# Altium schematic sheet 5-BLOCK-2X2-DUAL.SchDoc
size A2
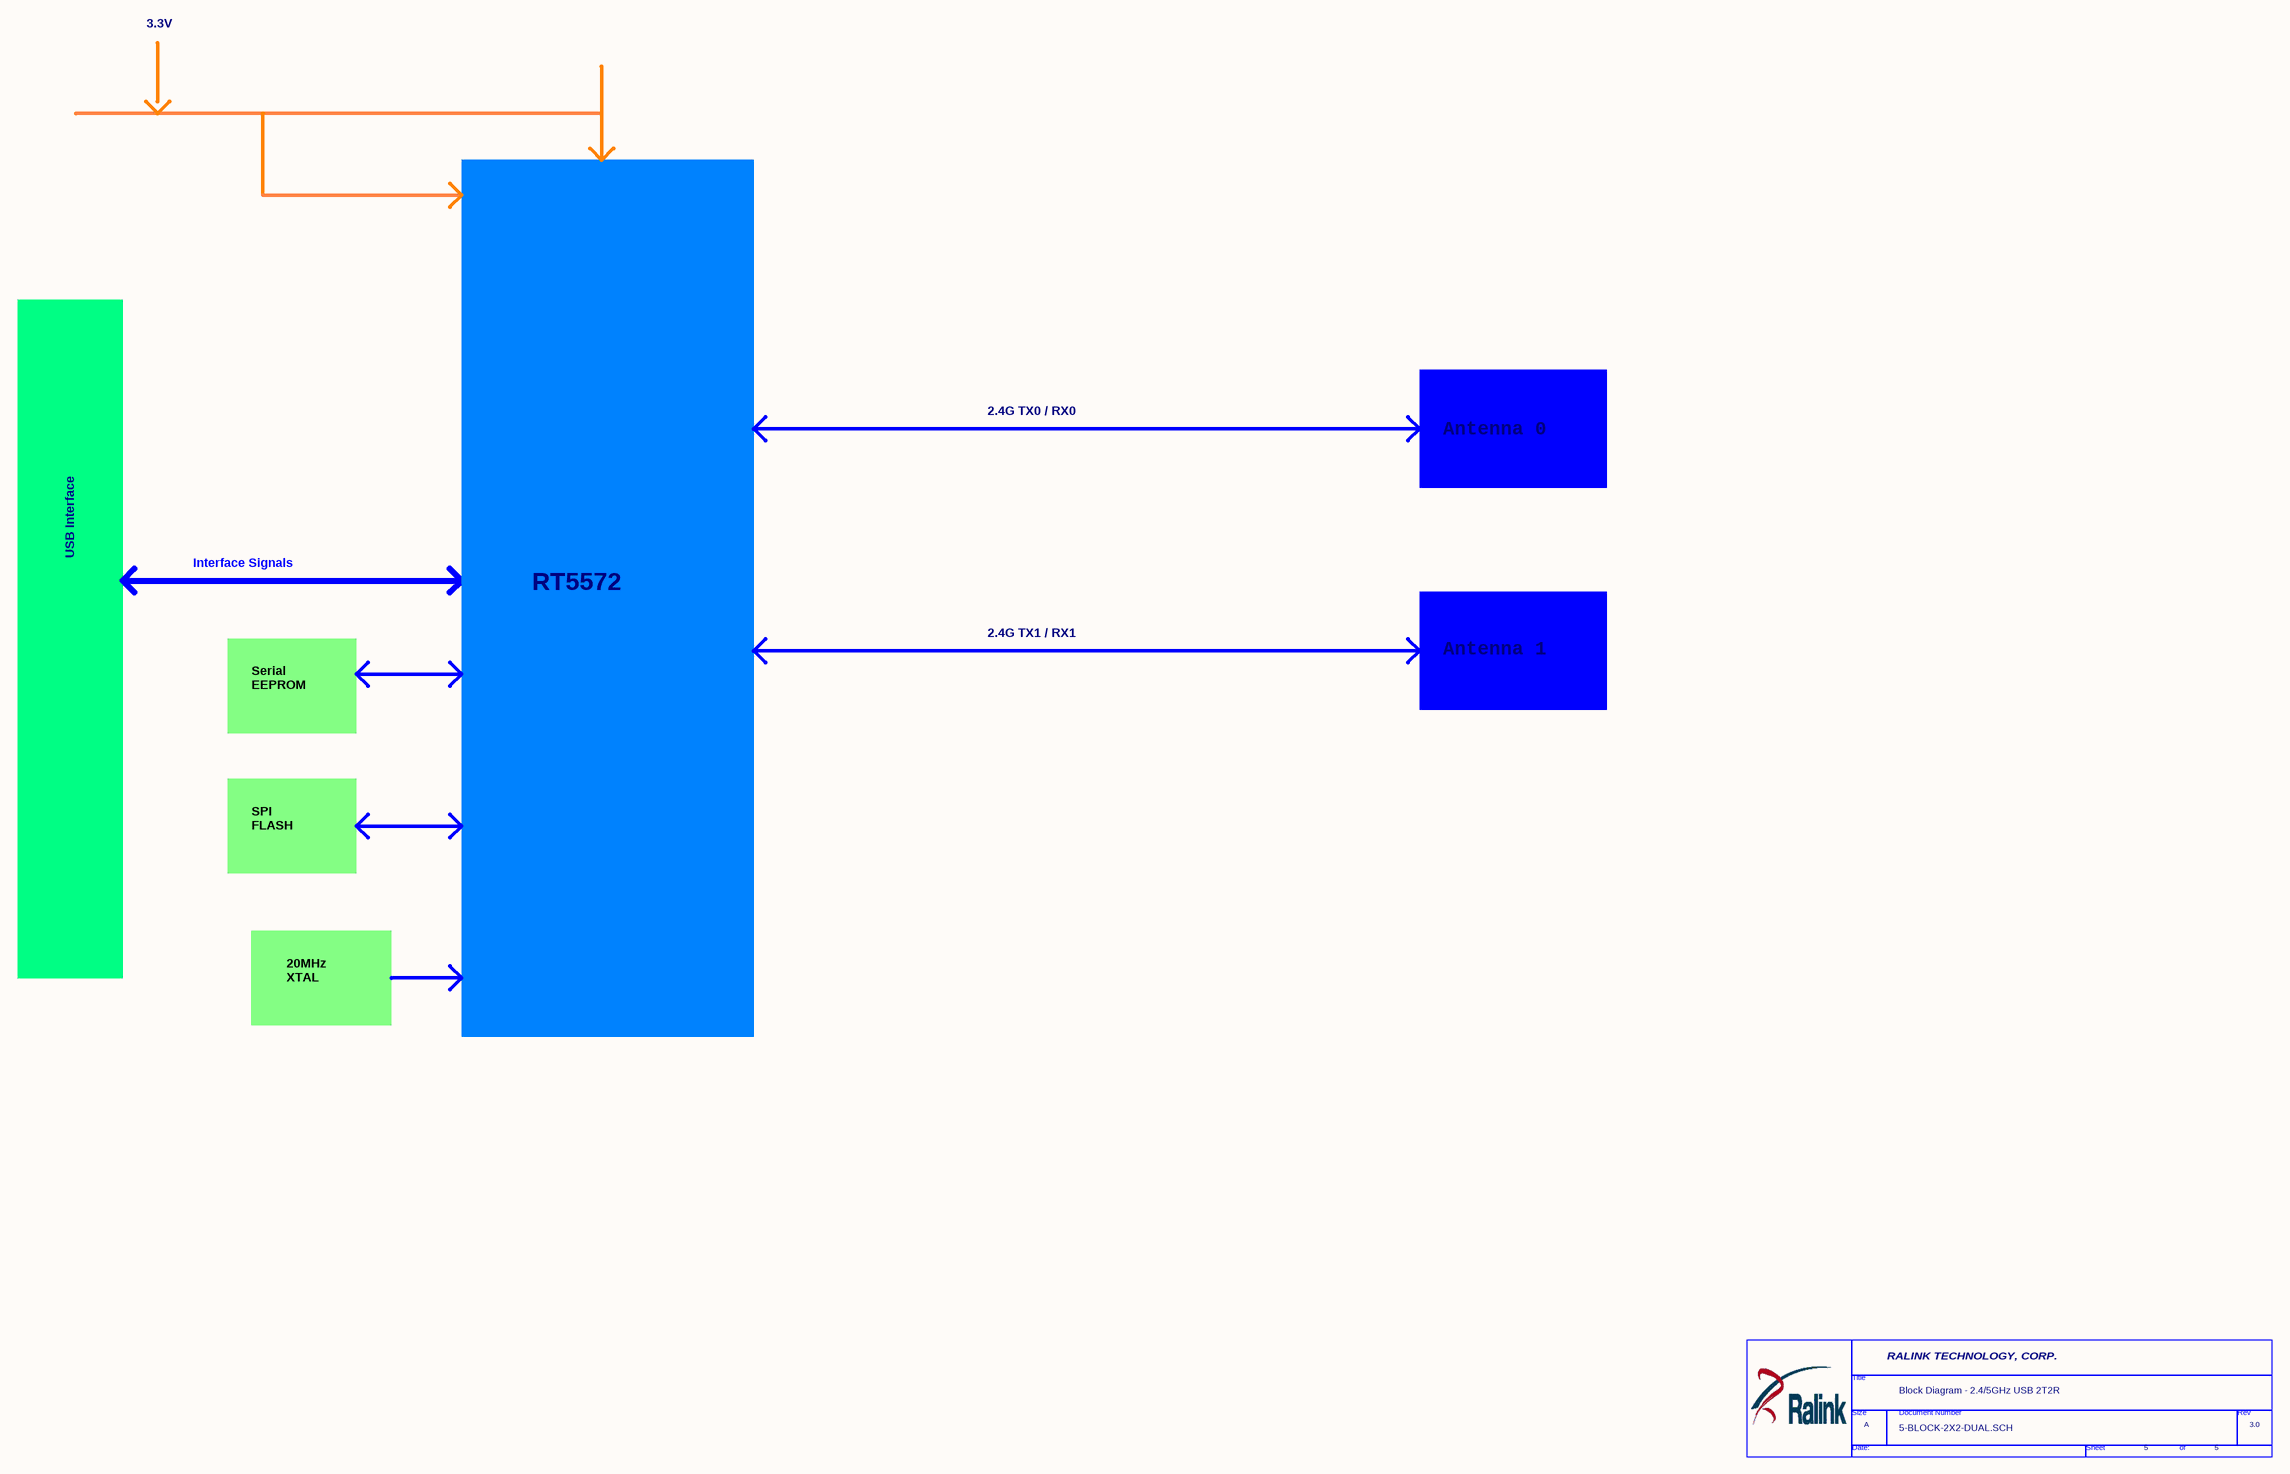
[diagram p0: 5-BLOCK-2X2-DUAL.SchDoc]

## Parts
*  Page Count: 5  Page Size: A  OrgName: RALINK TECHNOLOGY, CORP.  Title: Block Diagram - 2.4/5GHz USB 2T2R  RevCode: 3.0  Doc: 5-BLOCK-2X2-DUAL.SCH  (hidden comment: TitleBlock1-RA-new)  (graphical)

## Notes on the sheet
- 3.3V
- 2.4G TX0 / RX0
- Antenna 0
- USB Interface
- Interface Signals
- RT5572
- 2.4G TX1 / RX1
- Antenna 1
- Serial
  EEPROM
- SPI
  FLASH
- 20MHz
  XTAL
- (in symbol TitleBlock1-RA-new) Title; Size; Document Number; Rev; Date:; Sheet; of

## Library data of the parts
* = TitleBlock1-RA-new: Page Number: 5; Page Create Date: March  8, 1995